# Altium schematic sheet 20210316_finger_texter.SchDoc
size A4
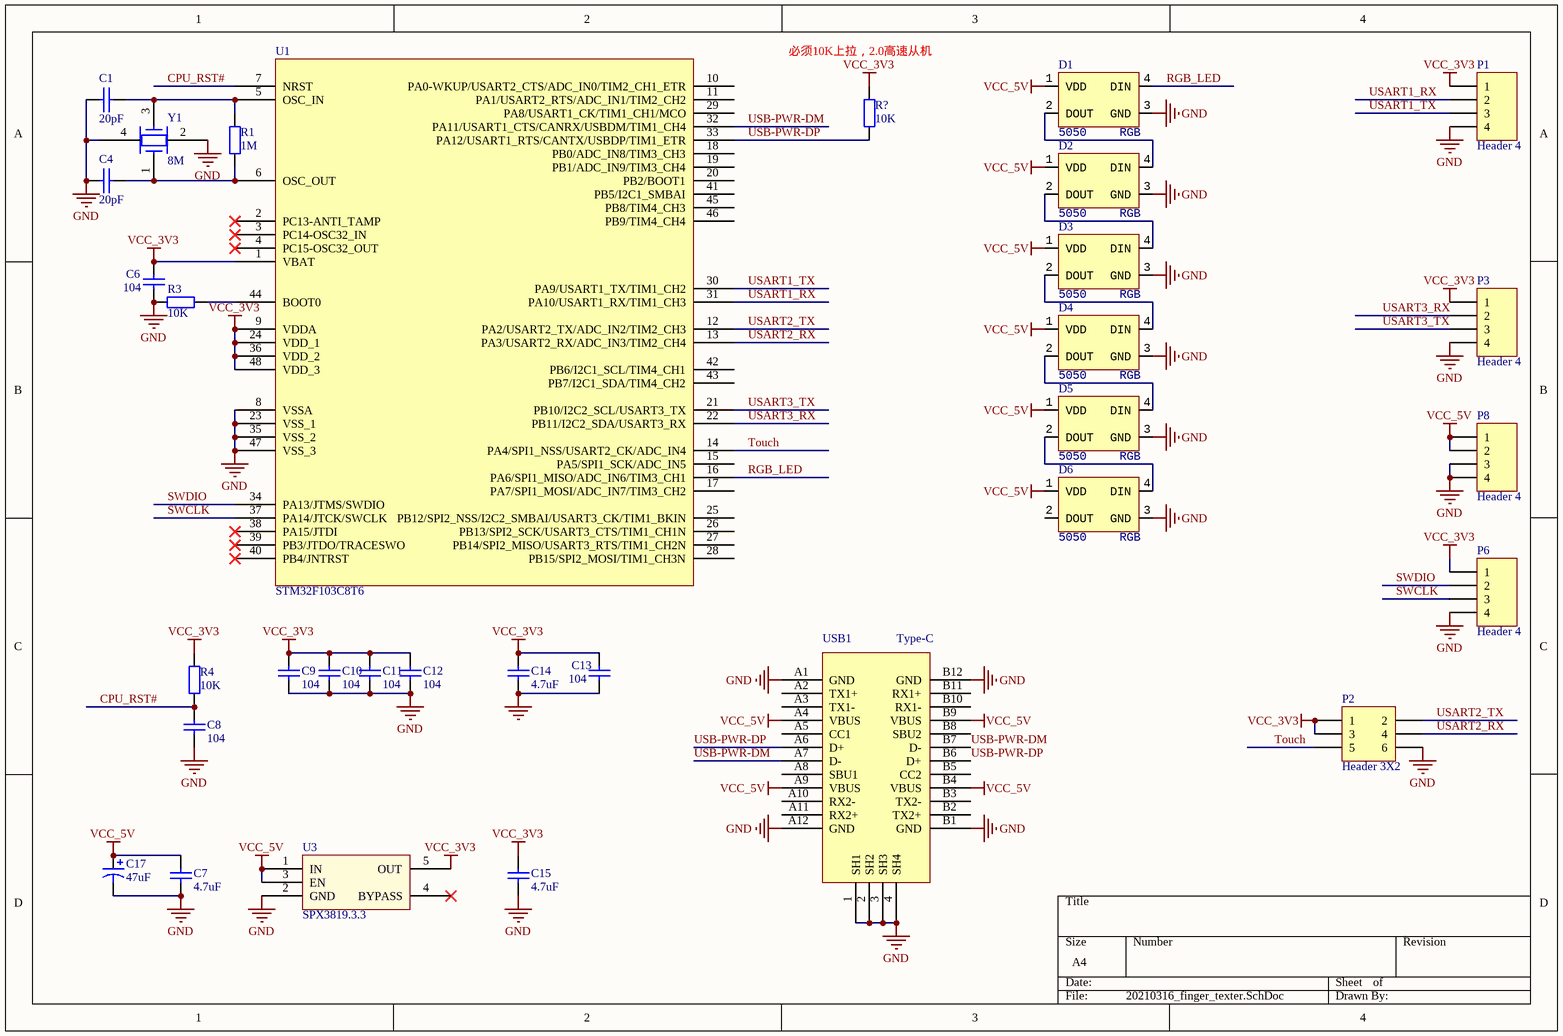
[diagram p0: 20210316_finger_texter.SchDoc]

## Parts
C1  20pF  [C0603]
C4  20pF  [C0603]
C6  104  [C0603]
C7  4.7uF  [C0603]
C8  104  [C0603]
C9  104  [C0603]
C10  104  [C0603]
C11  104  [C0603]
C12  104  [C0603]
C13  104  [C0603]
C14  4.7uF  [C0603]
C15  4.7uF  [C0603]
C17  47uF  [6032-C/P]
D1  Type: 5050  [LED_5050_WS2812B]  (hidden comment: RGB)
D2  Type: 5050  [LED_5050_WS2812B]  (hidden comment: RGB)
D3  Type: 5050  [LED_5050_WS2812B]  (hidden comment: RGB)
D4  Type: 5050  [LED_5050_WS2812B]  (hidden comment: RGB)
D5  Type: 5050  [LED_5050_WS2812B]  (hidden comment: RGB)
D6  Type: 5050  [LED_5050_WS2812B]  (hidden comment: RGB)
P1  Header 4  [HDR1X4]
P2  Header 3X2  [HDR2X3]
P3  Header 4  [HDR1X4]
P6  Header 4  [HDR1X4]
P8  Header 4  [HDR1X4]
R1  1M  [R0603]
R3  10K  [R0603]
R4  10K  [R0603]
R?  10K  [R0603]
U1  STM32F103C8T6  [FQFP-S0.5--G48/N]
U3  SPX3819.3.3  [SOT23-5]
USB1  Type-C  [Type-C-TOP]
Y1  8M  [SMD3225]

## Nets
GND: C1.2 C4.2 C6.2 C7.2 C8.1 C9.2 C10.2 C11.2 C12.2 C13.2 C14.2 C15.2 C17.2 D1.3(GND) D2.3(GND) D3.3(GND) D4.3(GND) D5.3(GND) D6.3(GND) P1.4 P2.6 P3.4 P6.4 P8.3 P8.4 R3.1 U1.8(VSSA) U1.23(VSS_1) U1.35(VSS_2) U1.47(VSS_3) U3.2(GND) USB1.1(SH1) USB1.2(SH2) USB1.3(SH3) USB1.4(SH4) USB1.A1(GND) USB1.A12(GND) USB1.B1(GND) USB1.B12(GND) Y1.2 Y1.4
VCC_3V3: C6.1 C9.1 C10.1 C11.1 C12.1 C13.1 C14.1 C15.1 P1.1 P2.1 P2.3 P3.1 P6.1 R4.2 R?.2 U1.1(VBAT) U1.9(VDDA) U1.24(VDD_1) U1.36(VDD_2) U1.48(VDD_3) U3.5(OUT)
VCC_5V: C7.1 C17.1 D1.1(VDD) D2.1(VDD) D3.1(VDD) D4.1(VDD) D5.1(VDD) D6.1(VDD) P8.1 P8.2 U3.1(IN) U3.3(EN) USB1.A4(VBUS) USB1.A9(VBUS) USB1.B4(VBUS) USB1.B9(VBUS)
CPU_RST#: C8.2 R4.1 U1.7(NRST)
RGB_LED: D1.4(DIN) U1.16(PA6/SPI1_MISO/ADC_IN6/TIM3_CH1)
SWCLK: P6.3 U1.37(PA14/JTCK/SWCLK)
SWDIO: P6.2 U1.34(PA13/JTMS/SWDIO)
Touch: P2.5 U1.14(PA4/SPI1_NSS/USART2_CK/ADC_IN4)
USART1_RX: P1.2 U1.31(PA10/USART1_RX/TIM1_CH3)
USART1_TX: P1.3 U1.30(PA9/USART1_TX/TIM1_CH2)
USART2_RX: P2.4 U1.13(PA3/USART2_RX/ADC_IN3/TIM2_CH4)
USART2_TX: P2.2 U1.12(PA2/USART2_TX/ADC_IN2/TIM2_CH3)
USART3_RX: P3.2 U1.22(PB11/I2C2_SDA/USART3_RX)
USART3_TX: P3.3 U1.21(PB10/I2C2_SCL/USART3_TX)
USB-PWR-DM: U1.32(PA11/USART1_CTS/CANRX/USBDM/TIM1_CH4) USB1.A7(D-) USB1.B7(D-)
USB-PWR-DP: R?.1 U1.33(PA12/USART1_RTS/CANTX/USBDP/TIM1_ETR) USB1.A6(D+) USB1.B6(D+)
NetC1_1: C1.1 R1.2 U1.5(OSC_IN) Y1.3
NetC4_1: C4.1 R1.1 U1.6(OSC_OUT) Y1.1
NetD1_2: D1.2(DOUT) D2.4(DIN)
NetD2_2: D2.2(DOUT) D3.4(DIN)
NetD3_2: D3.2(DOUT) D4.4(DIN)
NetD4_2: D4.2(DOUT) D5.4(DIN)
NetD5_2: D5.2(DOUT) D6.4(DIN)
NetR3_2: R3.2 U1.44(BOOT0)

Not connected (* = marked no-connect by the designer): D6 2(DOUT); U1 2(PC13-ANTI_TAMP)* 3(PC14-OSC32_IN)* 4(PC15-OSC32_OUT)* 10(PA0-WKUP/USART2_CTS/ADC_IN0/TIM2_CH1_ETR) 11(PA1/USART2_RTS/ADC_IN1/TIM2_CH2) 15(PA5/SPI1_SCK/ADC_IN5) 17(PA7/SPI1_MOSI/ADC_IN7/TIM3_CH2) 18(PB0/ADC_IN8/TIM3_CH3) 19(PB1/ADC_IN9/TIM3_CH4) 20(PB2/BOOT1) 25(PB12/SPI2_NSS/I2C2_SMBAI/USART3_CK/TIM1_BKIN) 26(PB13/SPI2_SCK/USART3_CTS/TIM1_CH1N) 27(PB14/SPI2_MISO/USART3_RTS/TIM1_CH2N) 28(PB15/SPI2_MOSI/TIM1_CH3N) 29(PA8/USART1_CK/TIM1_CH1/MCO) 38(PA15/JTDI)* 39(PB3/JTDO/TRACESWO)* 40(PB4/JNTRST)* 41(PB5/I2C1_SMBAI) 42(PB6/I2C1_SCL/TIM4_CH1) 43(PB7/I2C1_SDA/TIM4_CH2) 45(PB8/TIM4_CH3) 46(PB9/TIM4_CH4); U3 4(BYPASS)*; USB1 A2(TX1+) A3(TX1-) A5(CC1) A8(SBU1) A10(RX2-) A11(RX2+) B2(TX2+) B3(TX2-) B5(CC2) B8(SBU2) B10(RX1-) B11(RX1+)

## Notes on the sheet
- (near R?) 必须10K上拉，2.0高速从机

## Library data of the parts
C1 C4 = CAP: Capacitor
C6 C8-C13 = Cap: 电容; Value: 100pF; Published: 8-Jun-2000; LatestRevisionDate: 17-Jul-2002; LatestRevisionNote: Re-released for DXP Platform.; PackageReference: RAD-0.3; Publisher: Altium Limited
C7 C14 C15 = Cap: Capacitor; Value: 1.0uF/50V; Published: 8-Jun-2000; LatestRevisionDate: 17-Jul-2002; LatestRevisionNote: Re-released for DXP Platform.; PackageReference: RAD-0.3; Publisher: Altium Limited; PackageDescription: Radial Cap, Thru-Hole; 2 Leads; 0.3 in Pin Spacing
C17 = Cap Pol1: Polarized Capacitor (Radial); Value: 100pF; Published: 8-Jun-2000; LatestRevisionDate: 17-Jul-2002; LatestRevisionNote: Re-released for DXP Platform.; PackageReference: RB7.6-15; Publisher: Altium Limited; PackageDescription: Polarized Capacitor (Radial); 2 Leads
D1-D6 = LED_5050_WS2812B: LED; Value: RGB
P1 P3 P6 P8 = Header 4: Header, 4-Pin; LatestRevisionDate: 17-Jul-2002; LatestRevisionNote: Re-released for DXP Platform.; Publisher: Altium Limited
P2 = Header 3X2: Header, 3-Pin, Dual row; LatestRevisionDate: 17-Jul-2002; LatestRevisionNote: Re-released for DXP Platform.; Publisher: Altium Limited
R1 R3 R4 R? = Res: 电阻; Value: 1K; Published: 8-Jun-2000; LatestRevisionDate: 17-Jul-2002; LatestRevisionNote: Re-released for DXP Platform.; PackageReference: R0603; Publisher: Altium Limited
U1 = STM32F103xx
U3 = SPX3819.3.3: LDO
USB1 = USB-Type-C-TOP
Y1 = 3225